# Altium schematic sheet i2c.SchDoc
size A4
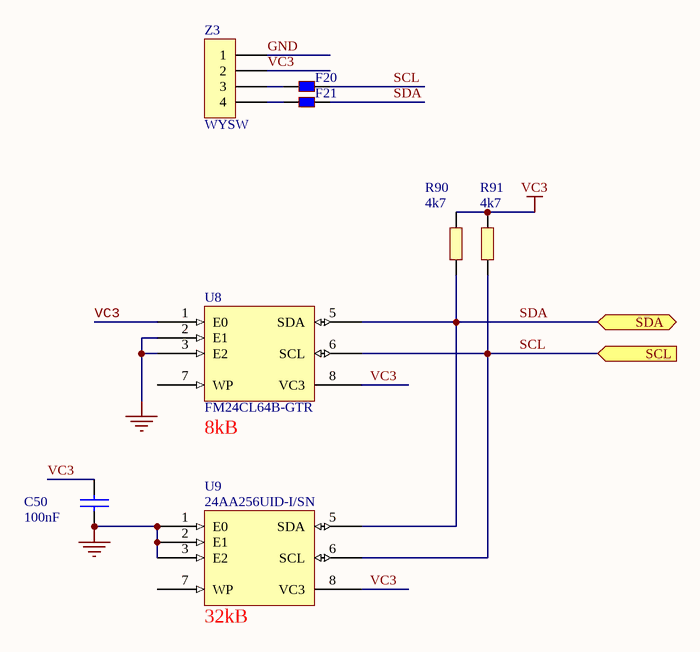
[diagram p0: i2c.SchDoc]

## Parts
C50  100nF  [0603C]
F20  BLM18BB141SN1D  [0603R]  (value not drawn)
F21  BLM18BB141SN1D  [0603R]  (value not drawn)
R90  4k7  [0603R]
R91  4k7  [0603R]
U8  FM24CL64B-GTR  [SO8]
U9  24AA256UID-I/SN  [SO8]
Z3  WYSW  [SSD1306_PR]

## Ports
SCL (in), SDA (bidir)

## Nets
GND: C50.2 U8.2(E1) U8.3(E2) U8.4(GND) U9.1(E0) U9.2(E1) U9.3(E2) U9.4(GND) Z3.1
VC3: C50.1 R90.1 R91.1 U8.1(E0) U8.8(VC3) U9.8(VC3) Z3.2
SCL: F20.2 R91.2 U8.6(SCL) U9.6(SCL) ; port SCL
SDA: F21.2 R90.2 U8.5(SDA) U9.5(SDA) ; port SDA
NetF20_1: F20.1 Z3.3
NetF21_1: F21.1 Z3.4

Not connected (* = marked no-connect by the designer): U8 7(WP); U9 7(WP)

## Notes on the sheet
- (near U8) 8kB
- (near U9) 32kB

## Library data of the parts
C50 = CAP: Capacitor
F20 F21 = KORALIK: Koralik ferrytowy
R90 R91 = RES3
U8 U9 = AT24C02
Z3 = CON4: Connector